# Altium schematic sheet Power_Board.SchDoc: Board Power
size A4; Date: Not used; ApprovedBy: Not used; CheckedBy: Not used; Author: Not used; CompanyName: STMicroelectronics; DrawnBy: Not used; Engineer: Not used; Organization: Not used; Address1: Not used; Address2: Not used; Address3: Not used; Address4: Not used; DocumentNumber: Not used; Revision: Not used; SheetNumber: 20; SheetTotal: 22; CurrentTime: Not used; CurrentDate: Not used; Time: Not used; DocumentFullPathAndName: Not used; DocumentName: Not used; ModifiedDate: Not used; ImagePath: Not used; ProjectName: Not used; Application_BuildNumber: Not used
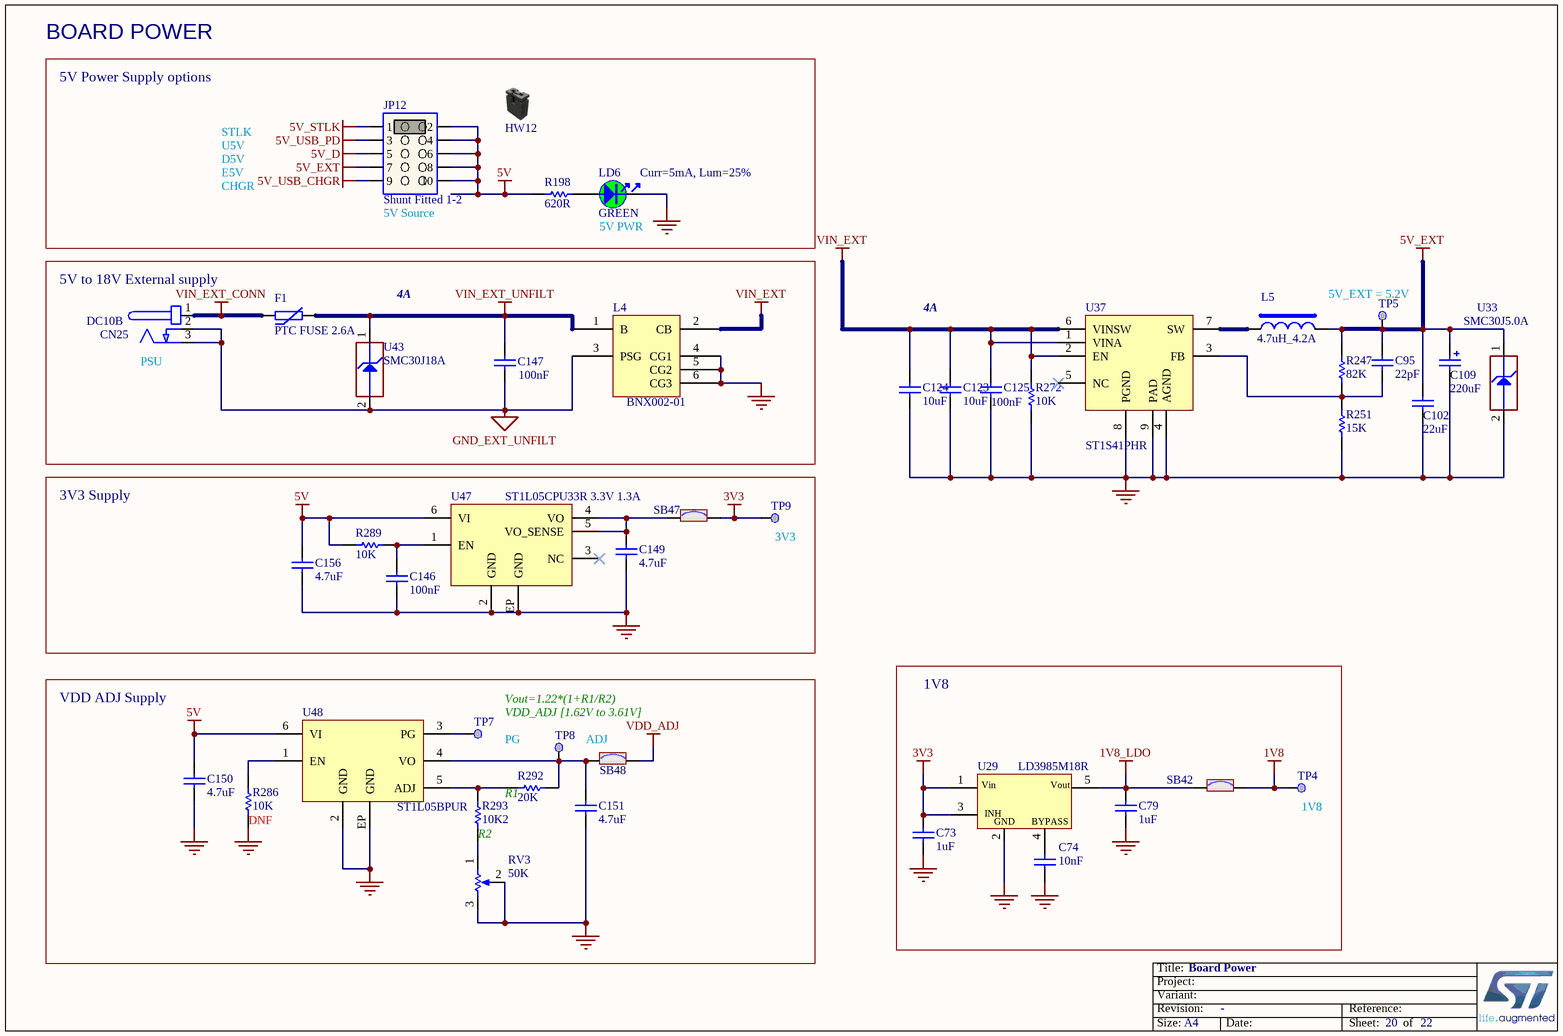
[diagram p0: Power_Board.SchDoc]

## Parts
C73  value 1uF  [C0603]  (hidden comment: Capacitor)
C74  value 10nF  [C0402]  (hidden comment: Capacitor)
C79  value 1uF  [C0603]  (hidden comment: Capacitor)
C95  value 22pF  [C0402]  (hidden comment: Capacitor)
C102  value 22uF  [C0805]  (hidden comment: Capacitor)
C109  value 220uF  [CPOL_TAJ-C_2312_H2P6]  (hidden comment: Cap_POL_TANA)
C123  value 10uF  [C1210]  (hidden comment: Capacitor)
C124  value 10uF  [C1210]  (hidden comment: Capacitor)
C125  value 100nF  [C0402]  (hidden comment: Capacitor)
C146  value 100nF  [C0402]  (hidden comment: Capacitor)
C147  value 100nF  [C0402]  (hidden comment: Capacitor)
C149  value 4.7uF  [C0603]  (hidden comment: Capacitor)
C150  value 4.7uF  [C0603]  (hidden comment: Capacitor)
C151  value 4.7uF  [C0603]  (hidden comment: Capacitor)
C156  value 4.7uF  [C0603]  (hidden comment: Capacitor)
CN25  value DC10B  [CON_DC-POWER-SOCKET_CLIFF_FC68149_DC10B]  (hidden comment: Power_Jack_DC10B)
F1  value PTC FUSE 2.6A  [PTC_BEL-FUSE_1812_0ZCG0260FF2C]  (hidden comment: 0ZCG0260FF2C)
HW12  Shunt Black 2.54mm  (value not drawn)  (mechanical)
JP12  value Shunt Fitted 1-2  [CON_SAMTEC_TSW-105-07-X-D]  (hidden comment: Jumper_Header 5x2 Fitted 1-2)
L4  BNX002-01  [FIL_MURATA_BNX002-01]
L5  value 4.7uH_4.2A  [IND_TDK_VLS6045EX-4R7M]  (hidden comment: INDUCTOR_POWER)
LD6  value GREEN  [LED_0603_OSRAM_LG-Q396-PS-35_GREEN_1A2K_H0P4]  (hidden comment: LED_green)
R198  value 620R  [R0603]  (hidden comment: Resistor)
R247  value 82K  [R0402]  (hidden comment: Resistor)
R251  value 15K  [R0402]  (hidden comment: Resistor)
R272  value 10K  [R0402]  (hidden comment: Resistor)
R286  value 10K  [R0402]  (hidden comment: Resistor)
R289  value 10K  [R0402]  (hidden comment: Resistor)
R292  value 20K  [R0603]  (hidden comment: Resistor)
R293  value 10K2  [R0603]  (hidden comment: Resistor)
RV3  value 50K  [POT_BOURNS_3386P]  (hidden comment: POTENTIOMETER)
SB42  SB_ON  [SOLDER-BRIDGE_R0603-0R]  (value not drawn)
SB47  SB_ON  [SOLDER-BRIDGE_R0603-0R]  (value not drawn)
SB48  SB_ON  [SOLDER-BRIDGE_R0603-0R]  (value not drawn)
TP4  Test Point  [TP_SMD_1MM]  (value not drawn)  (no BOM)
TP5  Test Point  [TP_SMD_1MM]  (value not drawn)  (no BOM)
TP7  Test Point  [TP_SMD_1MM]  (value not drawn)  (no BOM)
TP8  Test Point  [TP_SMD_1MM]  (value not drawn)  (no BOM)
TP9  Test Point  [TP_SMD_1MM]  (value not drawn)  (no BOM)
U29  LD3985M18R  [REG_SOT23-5L]
U33  value SMC30J5.0A  [DIO_SMC_DO214-AB_1K_2A]  (hidden comment: ESD-TRANSIL)
U37  value ST1S41PHR  [ICC_HSOP8-EPAD_3P90X4P90_P127]  (hidden comment: ST1S41)
U43  value SMC30J18A  [DIO_SMC_DO214-AB_1K_2A]  (hidden comment: ESD-TRANSIL)
U47  value ST1L05CPU33R 3.3V 1.3A  [ICC_DFN6-EPAD_3X3_P095]  (hidden comment: ST1L05CPU33R)
U48  ST1L05BPUR  [ICC_DFN6-EPAD_3X3_P095]

## Blocks framed on the sheet
BOARD POWER: HW12 JP12 LD6 R198
5V to 18V External supply: C147 CN25 F1 L4 U43
3V3 Supply: C146 C149 C156 R289 SB47 TP9 U47
1V8: C73 C74 C79 SB42 TP4 U29
VDD ADJ Supply: C150 C151 R286 R292 R293 RV3 SB48 TP7 TP8 U48

## Nets
1V8: SB42.2 TP4.1
1V8_LDO: C79.2 SB42.1 U29.5(Vout)
3V3: C73.2 SB47.2 TP9.1 U29.1(Vin) U29.3(CE)
5V: C150.1 C156.2 JP12.2 JP12.4 JP12.6 JP12.8 JP12.10 R198.1 R289.2 U47.6(VI) U48.6(VI)
5V_D: JP12.5
5V_EXT: C95.2 C102.2 C109.1 JP12.7 L5.2 R247.2 TP5.1 U33.1(IO1)
5V_STLK: JP12.1
5V_USB_CHGR: JP12.9
5V_USB_PD: JP12.3
GND: C73.1 C74.1 C79.1 C102.1 C109.2 C123.1 C124.1 C125.1 C146.2 C149.1 C150.2 C151.1 C156.1 L4.4(CG1) L4.5(CG2) L4.6(CG3) LD6.2 R251.1 R272.1 R286.2 RV3.2(TAP) RV3.3(TOP) U29.2(GND) U33.2(GND) U37.4(AGND) U37.8(PGND) U37.9(PAD) U47.2(GND) U47.EP(GND) U48.2(GND) U48.EP(GND)
GND_EXT_UNFILT: C147.2 CN25.2 CN25.3 L4.3(PSG) U43.2(GND)
VDD_ADJ: SB48.2
VIN_EXT: C123.2 C124.2 C125.2 L4.2(CB) R272.2 U37.1(VINA) U37.2(EN) U37.6(VINSW)
VIN_EXT_CONN: CN25.1 F1.1
VIN_EXT_UNFILT: C147.1 F1.2 L4.1(B) U43.1(IO1)
NetC74_2: C74.2 U29.4(BYPASS)
NetC95_1: C95.1 R247.1 R251.2 U37.3(FB)
NetC146_1: C146.1 R289.1 U47.1(EN)
NetC149_2: C149.2 SB47.1 U47.4(VO) U47.5(VO_SENSE)
NetC151_2: C151.2 R292.2 SB48.1 TP8.1 U48.4(VO)
NetL5_1: L5.1 U37.7(SW)
NetLD6_1: LD6.1 R198.2
NetR286_1: R286.1 U48.1(EN)
NetR292_1: R292.1 R293.2 U48.5(ADJ)
NetR293_1: R293.1 RV3.1(BOT)
NetTP7_1: TP7.1 U48.3(PG)

Not connected (* = marked no-connect by the designer): U37 5(NC)*; U47 3(NC)*

## Notes on the sheet
- 5V Power Supply options
- D5V
- E5V
- U5V
- STLK
- (near LD6) Curr=5mA, Lum=25%
- CHGR
- (near JP12) 5V Source
- 5V PWR
- (near U43) 4A
- 4A
- (near TP5) 5V_EXT = 5.2V
- (near CN25) PSU
- (near TP9) 3V3
- Vout=1.22*(1+R1/R2)
- VDD_ADJ [1.62V to 3.61V]
- PG
- (near SB48) ADJ
- (near R286) DNF
- (near R293) R2
- (near R292) R1
- (near TP4) 1V8
- Title:
- Project:
- Size:
- Revision:
- Variant:
- A4
- -
- Date:
- Reference:
- Sheet:
- of
- (in symbol MCD-00078) INH

## Library data of the parts
C73 C79 = MCD-00010: Capacitor, MLCC, 1uF, 16V, X5R, 10%, 0603, T=0,8mm; Manufacturer_Part_Number: CC0603KRX5R7BB105; Manufacturer: YAGEO; Provided_By: SUBCO; Initial_Board_Reference: MB1274; Path: ws/MCD_ApplicationBoards/Lists/MCDPARTSdatabase; Item Type: Item; Internal_Part_Number: MCD-00010; Status: Released; Part_Type: Capacitor; Package: C0603; ComponentLink1Description: Datasheet; ComponentLink1URL: http://tunmcdsvn.tun.st.com/Component_Datasheet_Library/Trunk/Capacitors/Yageo_Multilayer_capacitor_X5R_series_100pF_to_100uF
C74 = MCD-00011: Capacitor, MLCC, 10nF, 16V, X7R, 10%, 0402, T=0.5mm; Manufacturer_Part_Number: CC0402KRX7R7BB103; Manufacturer: YAGEO; Provided_By: SUBCO; Initial_Board_Reference: MB1274; Path: ws/MCD_ApplicationBoards/Lists/MCDPARTSdatabase; Item Type: Item; Internal_Part_Number: MCD-00011; Status: Released; Package: C0402; ComponentLink1Description: Datasheet; Part_Type: Capacitor; ComponentLink1URL: http://tunmcdsvn.tun.st.com/Component_Datasheet_Library/Trunk/Capacitors/Yageo_Multilayer_Capacitor_X7R_series_100pF_to_22uF
C95 = MCD-00203: Capacitor, MLCC, 22pF, 50V, C0G, 5%, 0402, T=0,5mm; Manufacturer_Part_Number: GRM1555C1H220JA01; Manufacturer: MURATA; Provided_By: SUBCO; Initial_Board_Reference: MBxxxx; Path: ws/MCD_ApplicationBoards/Lists/MCDPARTSdatabase; Item Type: Item; Internal_Part_Number: MCD-00203; Status: Released; Part_Type: Capacitor; Package: C0402; ComponentLink1Description: Datasheet; ComponentLink1URL: http://tunmcdsvn.tun.st.com/Component_Datasheet_Library/Trunk/Capacitors/Murata_Capacitor_GR_series
C102 = MCD-00101: Capacitor, MLCC, 22uF, 6V3, X5R, 20%, 0805, T=1,25mm; Manufacturer_Part_Number: GRM21BR60J226ME39L; Manufacturer: MURATA; Provided_By: SUBCO; Initial_Board_Reference: MB1262; Path: ws/MCD_ApplicationBoards/Lists/MCDPARTSdatabase; Item Type: Item; Internal_Part_Number: MCD-00101; Status: Released; Part_Type: Capacitor; Package: C0805; ComponentLink1Description: Datasheet; ComponentLink1URL: http://tunmcdsvn.tun.st.com/Component_Datasheet_Library/Trunk/Capacitors/Murata_Capacitor_GR_series
C109 = MCD-00142: Capacitor, Tantalum, 220uF, 10V, 10%, TypeC; Manufacturer_Part_Number: TAJC227K010R; Manufacturer: AVX; Provided_By: SUBCO; Initial_Board_Reference: MB1262; Path: ws/MCD_ApplicationBoards/Lists/MCDPARTSdatabase; Item Type: Item; Revision: July-2002: Re-released for DXP Platform.; Internal_Part_Number: MCD-00142; ComponentLink1Description: Datasheet; Status: Released; Part_Type: Capacitor; Package: C2312; ComponentLink1URL: http://tunmcdsvn.tun.st.com/Component_Datasheet_Library/Trunk/Capacitors/AVX_Capacitor_TAJ-series
C123 C124 = MCD-01056: Capacitor, X7R, 10µF, 50V, 20%, 1210, T=2.5mm; Manufacturer_Part_Number: C3225X7R1H106M250AC; Manufacturer: TDK; Provided_By: SUBCO; Initial_Board_Reference: MB1378; Remark: Footprint available C1210; Path: ws/MCD_ApplicationBoards/Lists/MCDPARTSdatabase; Item Type: Item; Internal_Part_Number: MCD-01056; Status: Footprint available; Part_Type: Capacitor; Package: C1210; ComponentLink1Description: Datasheet; ComponentLink1URL: http://tunmcdsvn.tun.st.com/Component_Datasheet_Library/Trunk/Capacitors/TDK_Capacitor_C-series; Order_Code_Farnell: 2547040
C125 C146 C147 = MCD-00006: Capacitor, MLCC, 100nF, 16V, X7R, 10%, 0402, T=0.5mm; Manufacturer_Part_Number: CC0402KRX7R7BB104; Manufacturer: YAGEO; Alternate_Manufacturer_Part_Number: GCM155R71C104KA55D; Alternate_Manufacturer: MURATA; Provided_By: SUBCO; Initial_Board_Reference: MB1274; Path: ws/MCD_ApplicationBoards/Lists/MCDPARTSdatabase; Item Type: Item; Internal_Part_Number: MCD-00006; Status: Released; Part_Type: Capacitor; Package: C0402; ComponentLink1Description: Datasheet; ComponentLink1URL: http://tunmcdsvn.tun.st.com/Component_Datasheet_Library/Trunk/Capacitors/Yageo_Multilayer_Capacitor_X7R_series_100pF_to_22uF
C149-C151 C156 = MCD-00009: Capacitor, MLCC, 4.7uF, 16V, X5R, 10%, 0603, T=0.8mm; Manufacturer_Part_Number: CC0603KRX5R7BB475; Manufacturer: YAGEO; Provided_By: SUBCO; Initial_Board_Reference: MB1274; Path: ws/MCD_ApplicationBoards/Lists/MCDPARTSdatabase; Item Type: Item; Internal_Part_Number: MCD-00009; Status: Released; Part_Type: Capacitor; Package: C0603; ComponentLink1Description: Datasheet; ComponentLink1URL: http://tunmcdsvn.tun.st.com/Component_Datasheet_Library/Trunk/Capacitors/Yageo_Multilayer_capacitor_X5R_series_100pF_to_100uF
CN25 = MCD-00173: DC-Power-Jack, 2.5mm, 5A, RA, TH; Manufacturer: CLIFF; Part_Type: Connector; BMS_Part_Number: 9087803; Provided_By: SUBCO; Initial_Board_Reference: MB1265; Path: ws/MCD_ApplicationBoards/Lists/MCDPARTSdatabase; Item Type: Item; Internal_Part_Number: MCD-00173; Manufacturer_Part_Number: DC10B; ComponentLink1Description: Datasheet; Status: Released; ComponentLink1URL: http://tunmcdsvn.tun.st.com/Component_Datasheet_Library/Trunk/Connectors/CLIFF_DC Power Connectors_DC10B
F1 = MCD-00624: SMD, PTC resettable fuse, IH:2.6A, IT:5A, Vdc_max:8V, Rmax:47mohm, BELFUSE; Part_Type: Misc; Provided_By: SUBCO; Initial_Board_Reference: MB1264; Path: ws/MCD_ApplicationBoards/Lists/MCDPARTSdatabase; Item Type: Item; Internal_Part_Number: MCD-00624; Status: Footprint available; Manufacturer_Part_Number: 0ZCG0260FF2C; Manufacturer: BELFUSE; ComponentLink1Description: Datasheet; ComponentLink1URL: http://tunmcdsvn.tun.st.com/Component_Datasheet_Library/Trunk/Misc/BELFUSE_FUSE_PTC_0ZCG_series
HW12 = MCD-00043: SHUNT 2.54mm BLACK; Part_Type: Mechanical; Manufacturer_Part_Number: SNT-100-BK-G; Manufacturer: SAMTEC; Provided_By: SUBCO; Initial_Board_Reference: MB1274; Value: SNT-100-BK-G; Path: ws/MCD_ApplicationBoards/Lists/MCDPARTSdatabase; Item Type: Item; Internal_Part_Number: MCD-00043; Status: Released; ComponentLink1Description: Datasheet; ComponentLink1URL: http://tunmcdsvn.tun.st.com/Component_Datasheet_Library/Trunk/Connectors/Samtec_Shunt_Jumper_SNT100
JP12 = MCD-01203: Header, 5x2, 2,54mm, VR, TH, Height 5.84mm/2.54mm - Shunt Fitted 1-2; Part_Type: Connector; Manufacturer_Part_Number: TSW-105-07-x-D; Manufacturer: SAMTEC; Provided_By: SUBCO; Initial_Board_Reference: MB1372; Path: ws/MCD_ApplicationBoards/Lists/MCDPARTSdatabase; Item Type: Item; Internal_Part_Number: MCD-01203; Status: Released; ComponentLink1Description: Datasheet; ComponentLink1URL: http://tunmcdsvn.tun.st.com/Component_Datasheet_Library/Trunk/Connectors/Samtec_TSW-HTSW-series
L4 = MCD-00150: Through HOLE DC power EMI line filter, 40dB min (1MHz - 1GHz) insertion loss; Manufacturer: MURATA; Part_Type: Inductor; BMS_Part_Number: 9049203; Provided_By: SUBCO; Initial_Board_Reference: MB1263; Path: ws/MCD_ApplicationBoards/Lists/MCDPARTSdatabase; Item Type: Item; Internal_Part_Number: MCD-00150; Value: BNX002-01; Manufacturer_Part_Number: BNX002-01; ComponentLink1Description: Datasheet; Status: Released; ComponentLink1URL: http://tunmcdsvn.tun.st.com/Component_Datasheet_Library/Trunk/Inductors/Murata_EMI filter_BNX0002-1
L5 = MCD-01239: FIXED IND 4.7UH 4.2A 35 MOHM SMD; Manufacturer_Part_Number: VLS6045EX-4R7M; Manufacturer: TDK; Provided_By: SUBCO; Initial_Board_Reference: MB1397; Path: ws/MCD_ApplicationBoards/Lists/MCDPARTSdatabase; Item Type: Item; Internal_Part_Number: MCD-01239; Status: Footprint available; Part_Type: Inductor; ComponentLink1Description: Datasheet; ComponentLink1URL: http://tunmcdsvn.tun.st.com/Component_Datasheet_Library/Trunk/Inductors/TDK_Inductor_VLS6045EX-4R7M
LD6 = MCD-00588: LED Green, 0603 SMD, Forward Voltage Typ=2V, Max=2.5V; Part_Type: Display; Manufacturer_Part_Number: LG Q396-PS-35; Manufacturer: OSRAM OPTO SEMICONDUCTORS; Alternate_Manufacturer_Part_Number: VLMTG1300-GS08; Alternate_Manufacturer: VISHAY SEMICONDUCTOR OPTO DIVISION; Provided_By: SUBCO; Initial_Board_Reference: MB1331; Path: ws/MCD_ApplicationBoards/Lists/MCDPARTSdatabase; Item Type: Item; Internal_Part_Number: MCD-00588; Status: Released; Package: LED 0603; ComponentLink1Description: Datasheet; ComponentLink1URL: http://tunmcdsvn.tun.st.com/Component_Datasheet_Library/Trunk/Display/OSRAM_LED_GREEN_LG Q396-PS-35; Order_Code_Digikey: LG Q396-PS-35-ND
R198 = MCD-00500: Resistor,620R,0603,1%,1/10W; Manufacturer_Part_Number: RC0603FR-07620RL; Manufacturer: YAGEO; Provided_By: SUBCO; Initial_Board_Reference: MBxxxx; Path: ws/MCD_ApplicationBoards/Lists/MCDPARTSdatabase; Item Type: Item; Internal_Part_Number: MCD-00500; Status: Released; Part_Type: Resistor; Package: R0603; ComponentLink1Description: Datasheet; ComponentLink1URL: http://tunmcdsvn.tun.st.com/Component_Datasheet_Library/Trunk/Resistors/Yageo_Resistor_RC0603-series
R247 = MCD-00531: Resistor,82K,0402,1%,1/16W; Manufacturer_Part_Number: RC0402FR-0782KL; Manufacturer: YAGEO; Provided_By: SUBCO; Initial_Board_Reference: MBxxxx; Path: ws/MCD_ApplicationBoards/Lists/MCDPARTSdatabase; Item Type: Item; Internal_Part_Number: MCD-00531; Status: Released; Part_Type: Resistor; Package: R0402; ComponentLink1Description: Datasheet; ComponentLink1URL: http://tunmcdsvn.tun.st.com/Component_Datasheet_Library/Trunk/Resistors/Yageo_Resistor_RC0402-series
R251 = MCD-00285: Resistor,15K,0402,5%,1/16W; Manufacturer_Part_Number: RC0402JR-0715KL; Manufacturer: YAGEO; Provided_By: SUBCO; Initial_Board_Reference: MB1329; Path: ws/MCD_ApplicationBoards/Lists/MCDPARTSdatabase; Item Type: Item; Internal_Part_Number: MCD-00285; Status: Released; Part_Type: Resistor; Package: R0402; ComponentLink1Description: Datasheet; ComponentLink1URL: http://tunmcdsvn.tun.st.com/Component_Datasheet_Library/Trunk/Resistors/Yageo_Resistor_RC0402-series
R272 R286 R289 = MCD-00053: Resistor,10K,0402,1%,1/16W; Manufacturer_Part_Number: RC0402FR-0710KL; Manufacturer: YAGEO; Provided_By: SUBCO; Initial_Board_Reference: MB1274; Path: ws/MCD_ApplicationBoards/Lists/MCDPARTSdatabase; Item Type: Item; Internal_Part_Number: MCD-00053; Status: Released; Part_Type: Resistor; Package: R0402; ComponentLink1Description: Datasheet; ComponentLink1URL: http://tunmcdsvn.tun.st.com/Component_Datasheet_Library/Trunk/Resistors/Yageo_Resistor_RC0402-series
R292 = MCD-00422: Resistor,20K,0603,1%,1/10W; Manufacturer_Part_Number: RC0603FR-0720KL; Manufacturer: YAGEO; Provided_By: SUBCO; Initial_Board_Reference: MBxxxx; Path: ws/MCD_ApplicationBoards/Lists/MCDPARTSdatabase; Item Type: Item; Internal_Part_Number: MCD-00422; Status: Released; Part_Type: Resistor; Package: R0603; ComponentLink1Description: Datasheet; ComponentLink1URL: http://tunmcdsvn.tun.st.com/Component_Datasheet_Library/Trunk/Resistors/Yageo_Resistor_RC0603-series
R293 = MCD-01155: Resistor,10K2,0603,1%,1/10W; Manufacturer_Part_Number: RC0603FR-0710K2L; Manufacturer: YAGEO; Provided_By: SUBCO; Initial_Board_Reference: MB1372; Path: ws/MCD_ApplicationBoards/Lists/MCDPARTSdatabase; Item Type: Item; Internal_Part_Number: MCD-01155; Status: Released; Part_Type: Resistor; Package: R0603; ComponentLink1Description: Datasheet; ComponentLink1URL: http://tunmcdsvn.tun.st.com/Component_Datasheet_Library/Trunk/Resistors/Yageo_Resistor_RC0603-series
RV3 = MCD-01156: TRIMMER 50K OHM 0.5W PC PIN; Part_Type: Resistor; Manufacturer_Part_Number: 3386P-1-503; Manufacturer: BOURNS; Provided_By: SUBCO; Initial_Board_Reference: MB1372; Path: ws/MCD_ApplicationBoards/Lists/MCDPARTSdatabase; Item Type: Item; Internal_Part_Number: MCD-01156; Status: Released; ComponentLink1Description: Datasheet; ComponentLink1URL: http://tunmcdsvn.tun.st.com/Component_Datasheet_Library/Trunk/Resistors/Bourns_Potentiometer_3386_series
SB42 SB47 SB48 = MCD-00071: Solder Bridge ON; Part_Type: Mechanical; Manufacturer_Part_Number: RC0603JR-070RL; Manufacturer: YAGEO; Provided_By: SUBCO; Initial_Board_Reference: MB1274; Path: ws/MCD_ApplicationBoards/Lists/MCDPARTSdatabase; Item Type: Item; Internal_Part_Number: MCD-00071; Status: Released; ComponentLink1Description: Datasheet; Package: SB0603; ComponentLink1URL: http://tunmcdsvn.tun.st.com/Component_Datasheet_Library/Trunk/Resistors/Yageo_Resistor_RC0603-series
TP4 TP5 TP7-TP9 = MCD-00074: Test Point 1mm; Part_Type: Mechanical; Initial_Board_Reference: MB1274; Path: ws/MCD_ApplicationBoards/Lists/MCDPARTSdatabase; Item Type: Item; Internal_Part_Number: MCD-00074; Provided_By: n/a; Status: Released; ComponentLink1Description: Datasheet; ComponentLink1URL: http://na; Manufacturer: n/a; Manufacturer_Part_Number: n/a
U29 = MCD-00078: Ultra low drop-low noise BiCMOS voltage, regulators low ESR capacitors compatible; Manufacturer: STMICROELECTRONICS; Part_Type: IC; BMS_Part_Number: 9176159; Provided_By: SUBCO with ST control; Initial_Board_Reference: MB1274; Path: ws/MCD_ApplicationBoards/Lists/MCDPARTSdatabase; Item Type: Item; Value: LD3985M18R; Internal_Part_Number: MCD-00078; Manufacturer_Part_Number: LD3985M18R; ComponentLink1Description: Datasheet; Status: Released; ComponentLink1URL: http://tunmcdsvn.tun.st.com/Component_Datasheet_Library/Trunk/IC/STM_LDO_LD3985
U33 = MCD-01231: 3000 W Transil; Part_Type: Diode; Manufacturer: STMICROELECTRONICS; Provided_By: SUBCO with ST control; Initial_Board_Reference: MB1397; Path: ws/MCD_ApplicationBoards/Lists/MCDPARTSdatabase; Item Type: Item; Internal_Part_Number: MCD-01231; Status: Footprint available; Manufacturer_Part_Number: SMC30J5.0A; ComponentLink1Description: Datasheet; ComponentLink1URL: http://tunmcdsvn.tun.st.com/Component_Datasheet_Library/Trunk/Diodes/STM_ESD_SMC30J
U37 = MCD-01237: 4A step-down switching regulator; Part_Type: IC; Manufacturer: STMICROELECTRONICS; Provided_By: SUBCO with ST control; Initial_Board_Reference: MB1397; Path: ws/MCD_ApplicationBoards/Lists/MCDPARTSdatabase; Item Type: Item; Internal_Part_Number: MCD-01237; Status: Footprint available; Manufacturer_Part_Number: ST1S41PHR; Package: HSOP8; ComponentLink1Description: Datasheet; ComponentLink1URL: http://tunmcdsvn.tun.st.com/Component_Datasheet_Library/Trunk/IC/STM_Buck_converter_ST1S41
U43 = MCD-01238: 3000 W Transil; Part_Type: Diode; Manufacturer: STMICROELECTRONICS; Provided_By: SUBCO with ST control; Initial_Board_Reference: MB1397; Path: ws/MCD_ApplicationBoards/Lists/MCDPARTSdatabase; Item Type: Item; Internal_Part_Number: MCD-01238; Status: Footprint available; Manufacturer_Part_Number: SMC30J18A; ComponentLink1Description: Datasheet; ComponentLink1URL: http://tunmcdsvn.tun.st.com/Component_Datasheet_Library/Trunk/Diodes/STM_ESD_SMC30J
U47 = MCD-01025: LDO, 3.3V, 1.3A, Very low quiescent current BiCMOS voltage regulator; Part_Type: IC; Manufacturer: STMICROELECTRONICS; BMS_Part_Number: 9176246; Provided_By: SUBCO with ST control; Initial_Board_Reference: MB1331; Path: ws/MCD_ApplicationBoards/Lists/MCDPARTSdatabase; Item Type: Item; Internal_Part_Number: MCD-01025; Status: Released; Manufacturer_Part_Number: ST1L05CPU33R; Package: DFN6-3x3; ComponentLink1Description: Datasheet; ComponentLink1URL: http://tunmcdsvn.tun.st.com/Component_Datasheet_Library/Trunk/IC/STM_LDO_ST1L05CPU33R
U48 = MCD-00581: LDO Linear Voltage Regulator IC Positive Adjustable 1 Output Adjustable 1.3A 6-DFN (3x3); Manufacturer: STMICROELECTRONICS; BMS_Part_Number: 9176239; Provided_By: SUBCO with ST control; Initial_Board_Reference: MB1331; Path: ws/MCD_ApplicationBoards/Lists/MCDPARTSdatabase; Item Type: Item; Internal_Part_Number: MCD-00581; Value: ST1L05BPUR; Status: Released; Part_Type: IC; Manufacturer_Part_Number: ST1L05BPUR; Package: DFN6 (3x3); ComponentLink1Description: Datasheet; ComponentLink1URL: http://tunmcdsvn.tun.st.com/Component_Datasheet_Library/Trunk/IC/STM_LDO_ST1L05BPUR